# EAGLE design MEMS-preamp_v10 (EAGLE 8.6.0)
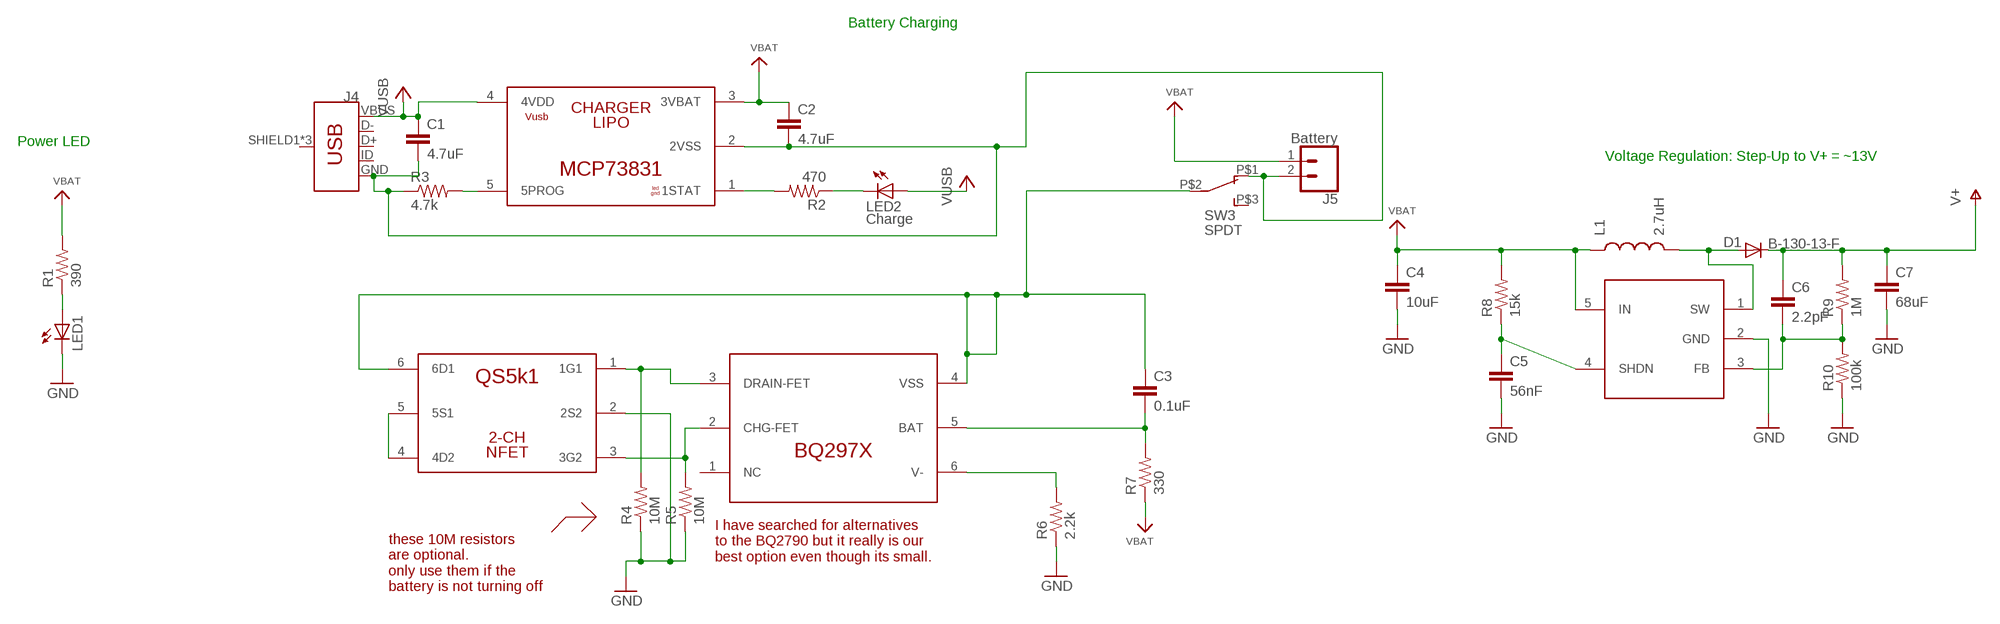
[diagram p0: schematic, sheet 1, part 1 of 2]
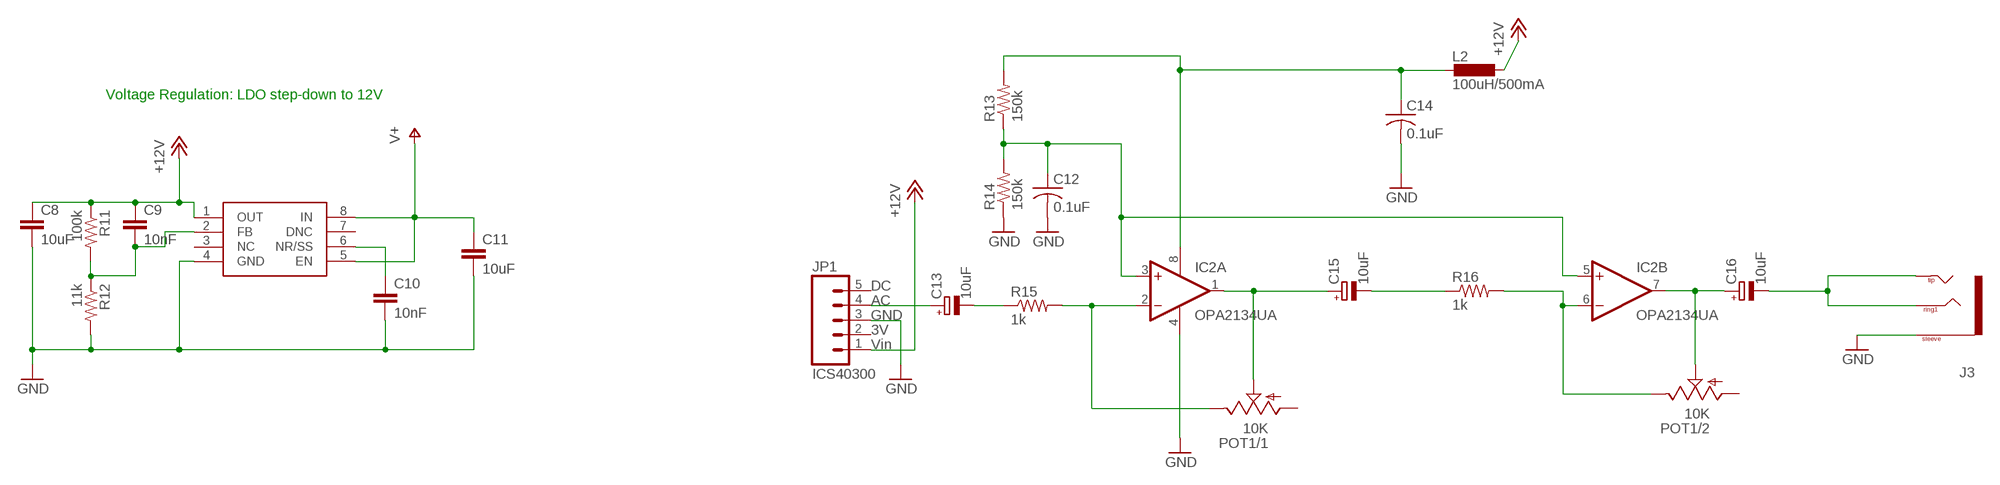
[diagram p1: schematic, sheet 1, part 2 of 2]

## Parts
C1  4.7uF  C-EUC0603  [C0603]
C2  4.7uF  C-EUC0603  [C0603]
C3  0.1uF  C-EUC0603  [C0603]
C4  10uF  C-EUC0603  [C0603]
C5  56nF  C-EUC0603  [C0603]
C6  2.2pF  C-EUC0603  [C0603]
C7  68uF  C-EUC1206  [C1206]
C8  10uF  C-EUC0603  [C0603]
C9  10nF  C-EUC0603  [C0603]
C10  10nF  C-EUC0603  [C0603]
C11  10uF  C-EUC0603  [C0603]
C12  0.1uF  C-USC0805  [C0805]
C13  10uF  CPOL-EUB  [PANASONIC_B]
C14  0.1uF  C-USC0805K  [C0805K]
C15  10uF  CPOL-EUB  [PANASONIC_B]
C16  10uF  CPOL-EUB  [PANASONIC_B]
D1  B-130-13-F  DIODESMA  [SMA-DIODE]
IC1  BQ297X  BQ297X-BATTERY-MANAGERLONG  [WSON-6-LONG]
IC2  OPA2134UA  [SO08]
IC3  MCP73831  [SOT-23-5]
IC4  SC4503  [SOT23-5]
IC5  TPS7A49  [MSOP-8]
IC6  QS6K1  [SOT457R_PHILIPS]
J3  TRS-1/8"-3.5MM  [TRS_SJ-3524-SMT]
J4  USB_MICRO-BREDUCED_PASTE  [USB-B-MICRO-SMD_RED_PASTE]
J5  Battery  CONN_02LOCK  [1X02_LOCK]
JP1  ICS40300  M05LOCK  [1X05_LOCK]
L1  2.7uH  INDUCTORCR54  [CR54]
L2  100uH/500mA  L-EUL3225M  [L3225M]
LED1  LED3MM  [LED3MM]
LED2  Charge  LED3MM  [LED3MM]
POT1  10K  POT-DUAL-PTV112-4420  [PTV112]
R1  390  R-US_R0603  [R0603]
R2  470  R-US_R0603  [R0603]
R3  4.7k  R-US_R0603  [R0603]
R4  10M  R-US_R0603  [R0603]
R5  10M  R-US_R0603  [R0603]
R6  2.2k  R-US_R0603  [R0603]
R7  330  R-US_R0603  [R0603]
R8  15k  R-US_R0603  [R0603]
R9  1M  R-US_R0603  [R0603]
R10  100k  R-US_R0603  [R0603]
R11  100k  R-US_R0603  [R0603]
R12  11k  R-US_R0603  [R0603]
R13  150k  R-US_R0603  [R0603]
R14  150k  R-US_R0603  [R0603]
R15  1k  R-US_R0603  [R0603]
R16  1k  R-US_R0603  [R0603]
SW3  SPDT  SWITCH_SPDTCL-SB-12B  [SWITCH_SPDT_CL-SB-12B]

## Nets
+5V: C1.1 IC3.4(4VDD) J4.VBUS LED2.A ; supply symbol labelled VUSB
+12V: C8.1 C9.1 IC5.1(OUT) JP1.1 L2.1 R11.1
BATGND: C3.1 IC1.4(VSS) IC6.6(6D1) SW3.P$2
GND: C4.2 C5.2 C7.2 C8.2 C10.2 C11.2 C12.2 C14.2 IC2.4(A:V-) IC4.2(GND) IC5.4(GND) IC6.2(2S2) J3.1(SLEEVE) JP1.3 LED1.K(C) R4.1 R5.1 R6.1 R10.1 R12.2 R14.1
N$2: LED1.A R1.1
N$3: C13.+ JP1.4
N$4: C15.- R16.1
N$5: IC2.2(A:-IN) POT1.1.3(/1:E) R15.2
N$6: IC3.5(5PROG) R3.2
N$7: C16.- J3.2(TIP) J3.3(RING1) J3.4(TIP)
N$8: C12.1 IC2.3(A:+IN) IC2.5(B:+IN) R13.1 R14.2
N$9: C15.+ IC2.1(A:OUT) POT1.1.2(/1:S)
N$10: C16.+ IC2.7(B:OUT) POT1.2.2(/2:S)
N$11: IC6.4(4D2) IC6.5(5S1)
N$12: D1.A IC4.1(SW) L1.P$2
N$13: C5.1 IC4.4(SHDN) R8.1
N$14: C6.2 IC4.3(FB) R9.1 R10.2
N$15: C14.1 IC2.8(A:V+) L2.2 R13.2
N$21: IC2.6(B:-IN) POT1.2.3(/2:E) R16.2
N$22: LED2.K(C) R2.1
N$23: C13.- R15.1
N$25: IC3.1(1STAT) R2.2
N$27: IC1.3(DRAIN-FET) IC6.1(1G1) R4.2
N$31: IC1.2(CHG-FET) IC6.3(3G2) R5.2
N$34: IC1.6(V-) R6.2
N$42: C3.2 IC1.5(BAT) R7.2
N$47: C9.2 IC5.2(FB) R11.2 R12.1
N$48: C10.1 IC5.6(NR/SS)
USBGND: C1.2 C2.2 IC3.2(2VSS) J4.GND J5.2 R3.1 SW3.P$1
V+: C6.1 C7.1 C11.1 D1.C IC5.5(EN) IC5.8(IN) R9.2
VBAT: C2.1 C4.1 IC3.3(3VBAT) IC4.5(IN) J5.1 L1.P$1 R1.2 R7.1 R8.2
Unconnected: IC1.1(NC) IC5.3(NC) IC5.7(DNC) J4.D+ J4.D- J4.ID J4.SHIELD1(SHIELD) J4.SHIELD2(SHIELD) J4.SHIELD3(SHIELD) JP1.2 JP1.5 POT1.1.1(/1:A) POT1.2.1(/2:A) SW3.P$3

## Notes on the sheet
- Battery Charging
- Power LED
- Voltage Regulation: Step-Up to V+ = ~13V | Voltage Regulation: LDO step-down to 12V
- I have searched for alternatives 
  to the BQ2790 but it really is our 
  best option even though its small.
- these 10M resistors
  are optional. 
  only use them if the 
  battery is not turning off

## Library data of the parts
C1-C11 = rcl:C-EU: CAPACITOR, European symbol; SPICEPREFIX: C
C12 C14 = adafruit:C-US: CAPACITOR, American symbol
C13 C15 C16 = CMU-ArtFab:CPOL-EU: POLARIZED CAPACITOR, European symbol
D1 = SparkFun:DIODE: Diode These are standard reverse protection diodes and small signal diodes. SMA package can handle up to about 1A. SOD-323 can handle about 200mA. What the SOD-323 package when ordering, there are some mfgs out there that are 5-pin packages.
IC1 = CMU-ArtFab:BQ297X-BATTERY-MANAGER
IC2 = linear:OPA2*: Dual Operational Amplifier Low Power, Single-Supply, Rail-To-Rail Operational Amplifier Source: http://focus.ti.com/lit/ds/symlink/opa2345.pdf http://focus.ti.com .. opa241.pdf http://focus.ti.com/lit/ds/symlink/opa2134.pdf
IC3 = CMU-ArtFab:MCP73831
IC4 = CMU-ArtFab:SC4503
IC5 = CMU-ArtFab:TPS7A49
IC6 = CMU-ArtFab:QS6K1
J3 = CMU-ArtFab:TRS-1/8"-3.5MM
J4 = CMU-ArtFab:USB_MICRO-B: USB Type Micro-B Connector Male/female and PTH/SMT variants SparkFun Products: SparkFun microB USB Breakout <https://www.sparkfun.com/products/12035> SparkFun USB microB Plug Breakout <https://www.sparkfun.com/products/10031> SparkFun ESP8266 Thing <https://www.sparkfun.com/products/13231>; PROD_ID: CONN-11752
J5 = SparkFun-Connectors:CONN_02: Multi connection point. Often used as Generic Header-pin footprint for 0.1 inch spaced/style header connections On any of the 0.1 inch spaced packages, you can populate with these: Break Away Headers - Straight <https://www.sparkfun.com/products/116> (PRT-00116) Break Away Male Headers - Right Angle <https://www.sparkfun.com/products/553> (PRT-00553) Female Headers <https://www.sparkfun.com/products/115> (PRT-00115) Break Away Headers - Machine Pin <https://www.sparkfun.com/products/117> (PRT-00117) Break Away Female Headers - Swiss Machine Pin <https://www.sparkfun.com/products/743> (PRT-00743) For SCREWTERMINALS and SPRING TERMINALS visit here: Screw Terimnals on SparkFun.com <https://www.sparkfun.com/search/results?term=Screw+Terminals> (5mm/3.5mm/2.54mm spacing) This device is also useful as a general connection point to wire up your design to another part of your project. Our various solder wires solder well into these plated through hole pads. Hook-Up Wire - Assortment (Stranded, 22 AWG) <https://www.sparkfun.com/products/11375> (PRT-11375) Hook-Up Wire - Assortment (Solid Core, 22 AWG) <https://www.sparkfun.com/products/11367> (PRT-11367) View the entire wire category on our website here <https://www.sparkfun.com/categories/141> Special notes: Molex polarized connector foot print use with: PRT-08233 with associated crimp pins and housings. 2.54_SCREWTERM for use with PRT-10571. 3.5mm Screw Terminal footprints for PRT-08084 5mm Screw Terminal footprints for use with PRT-08432
JP1 = SparkFun-Connectors:M05: Header 5 Standard 5-pin 0.1" header. Use with straight break away headers (SKU : PRT-00116), right angle break away headers (PRT-00553), swiss pins (PRT-00743), machine pins (PRT-00117), and female headers (PRT-00115). Molex polarized connector foot print use with SKU : PRT-08230 with associated crimp pins and housings.; CON1: Vin; CON2: 3V; CON3: GND; CON4: AC; CON5: DC
L1 = SparkFun-Passives:INDUCTOR: Inductors Basic Inductor/Choke - 0603 and 1206. Footprints are not proven and vary greatly between part numbers. SRN6045- 33uH, 20% 1.4A SDR0403-560KL - 56uH, 10%, 500mA RMS/740mA peak
L2 = rcl:L-EU: INDUCTOR, European symbol; SPICEPREFIX: L
LED1 LED2 = led:LED: LED OSRAM: - CHIPLED LG R971, LG N971, LY N971, LG Q971, LY Q971, LO R971, LY R971 LH N974, LH R974 LS Q976, LO Q976, LY Q976 LO Q996 - Hyper CHIPLED LW Q18S LB Q993, LB Q99A, LB R99A - SideLED LS A670, LO A670, LY A670, LG A670, LP A670 LB A673, LV A673, LT A673, LW A673 LH A674 LY A675 LS A676, LA A676, LO A676, LY A676, LW A676 LS A679, LY A679, LG A679 - Hyper Micro SIDELED® LS Y876, LA Y876, LO Y876, LY Y876 LT Y87S - SmartLED LW L88C, LW L88S LB L89C, LB L89S, LG L890 LS L89K, LO L89K, LY L89K LS L896, LA L896, LO L896, LY L896 - TOPLED LS T670, LO T670, LY T670, LG T670, LP T670 LSG T670, LSP T670, LSY T670, LOP T670, LYG T670 LG T671, LOG T671, LSG T671 LB T673, LV T673, LT T673, LW T673 LH T674 LS T676, LA T676, LO T676, LY T676, LB T676, LH T676, LSB T676, LW T676 LB T67C, LV T67C, LT T67C, LS T67K, LO T67K, LY T67K, LW E67C LS E67B, LA E67B, LO E67B, LY E67B, LB E67C, LV E67C, LT E67C LW T67C LS T679, LY T679, LG T679 LS T770, LO T770, LY T770, LG T770, LP T770 LB T773, LV T773, LT T773, LW T773 LH T774 LS E675, LA E675, LY E675, LS T675 LS T776, LA T776, LO T776, LY T776, LB T776 LHGB T686 LT T68C, LB T68C - Hyper Mini TOPLED® LB M676 - Mini TOPLED Santana® LG M470 LS M47K, LO M47K, LY M47K Source: http://www.osram.convergy.de LUXEON: - LUMILED® LXK2-PW12-R00, LXK2-PW12-S00, LXK2-PW14-U00, LXK2-PW14-V00 LXK2-PM12-R00, LXK2-PM12-S00, LXK2-PM14-U00 LXK2-PE12-Q00, LXK2-PE12-R00, LXK2-PE12-S00, LXK2-PE14-T00, LXK2-PE14-U00 LXK2-PB12-K00, LXK2-PB12-L00, LXK2-PB12-M00, LXK2-PB14-N00, LXK2-PB14-P00, LXK2-PB14-Q00 LXK2-PR12-L00, LXK2-PR12-M00, LXK2-PR14-Q00, LXK2-PR14-R00 LXK2-PD12-Q00, LXK2-PD12-R00, LXK2-PD12-S00 LXK2-PH12-R00, LXK2-PH12-S00 LXK2-PL12-P00, LXK2-PL12-Q00, LXK2-PL12-R00 Source: www.luxeon.com KINGBRIGHT: KA-3528ASYC Source: www.kingbright.com
POT1 = CMU-ArtFab:POT-DUAL-PTV112: Bourns 11mm dual potentiometer; AVAILABILITY: Unavailable; DESCRIPTION: Alt# Tce-10111410; MF: STMicroelectronics; MP: PTV112; PACKAGE: None; PRICE: None
R1-R16 = CMU-ArtFab:R-US_: RESISTOR, American symbol
SW3 = CMU-ArtFab:SWITCH_SPDT

## Board
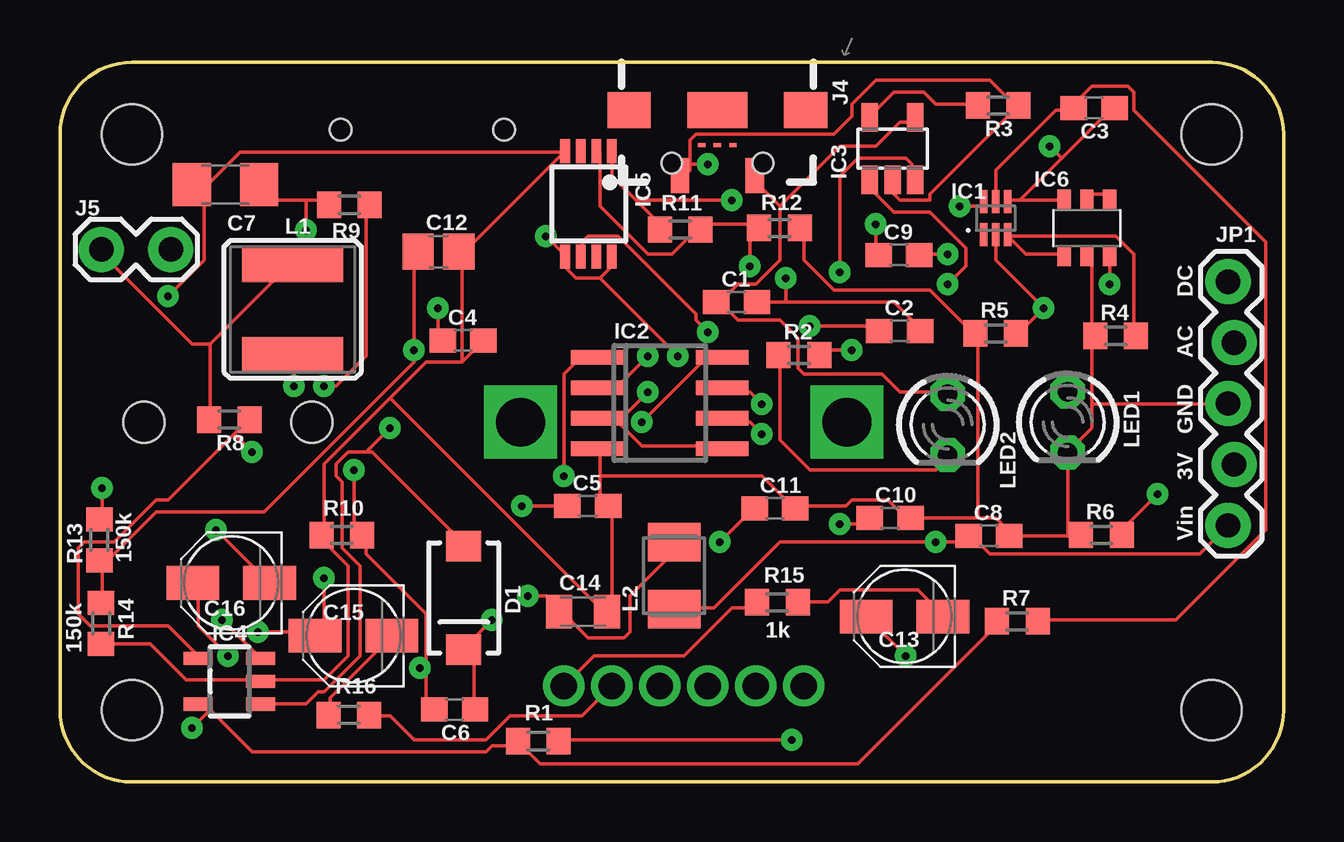
[diagram p2: board, top side]
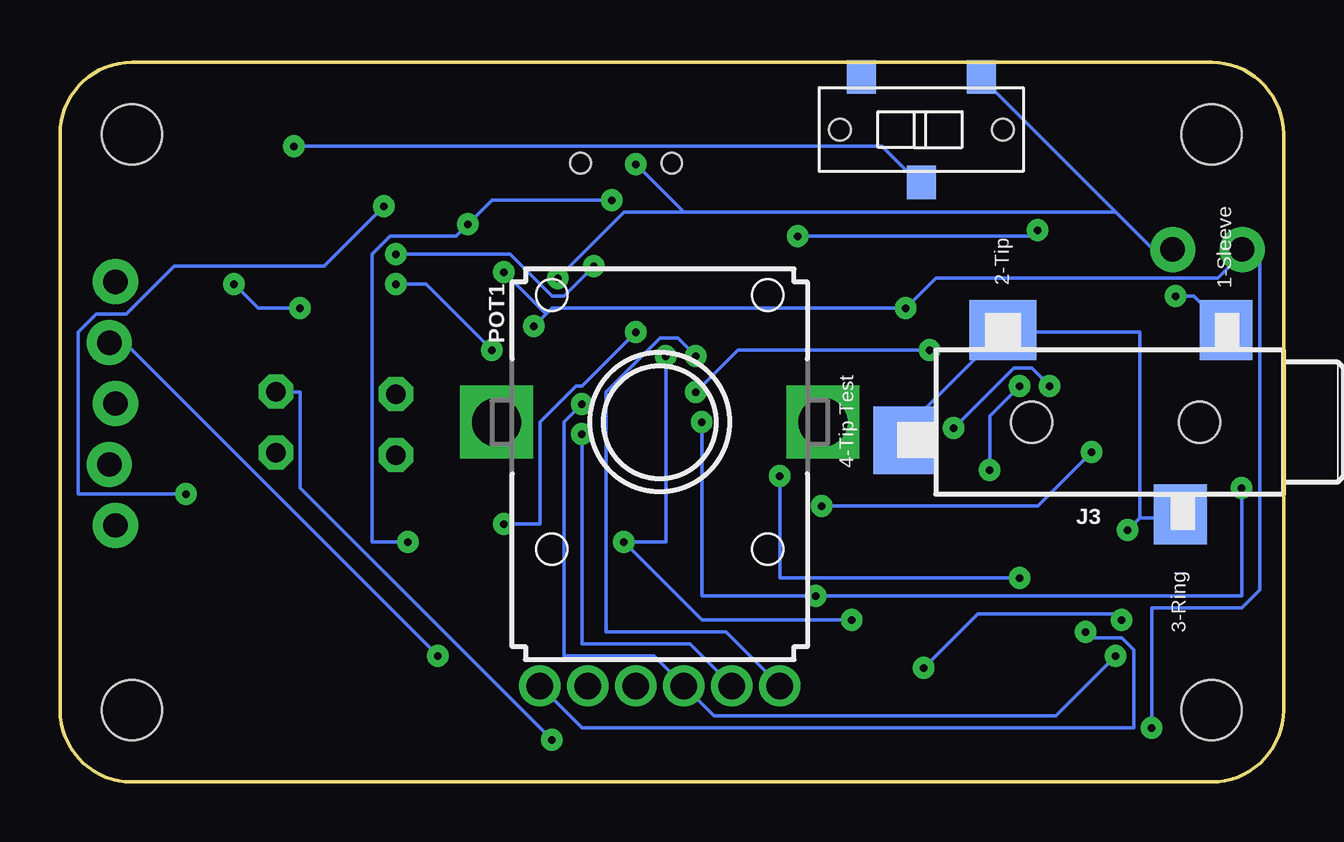
[diagram p3: board, bottom side, seen from below]

Size 51 x 30 mm. Coordinates in mm from the lower left corner, seen from the top.
Outline: 0,3 0,27 arc-90 3,30 48,30 arc-90 51,27 51,3 arc-90 48,0 3,0 arc-90 0,3
Copper layers (1*16): Top 0.035mm / dielectric 1.5mm / Bottom 0.035mm
Design rules "default *": minimum track width 6mil, minimum drill 12mil, track to track 6mil, track to pad 6mil, pad to pad 6mil, via to via 6mil, smd to smd 6mil, copper to edge 6mil, drill to drill 6mil, minimum pad ring 12mil, minimum via ring 12mil, stop-mask expansion 4mil, vias tented up to drill 0mil, thermal gap 10mil
Holes 2.5 mm at 48,27 48,3 3,27 3,3

### Footprints (pad centres in the part's own frame; a part is rotated, then mirrored left to right if it is on the bottom)
C0603 = smd 1.1 x 1: 1 -0.85,0; 2 0.85,0
C1206 = smd 1.6 x 1.8: 1 -1.4,0; 2 1.4,0
C0805 = smd 1.3 x 1.5: 1 -0.85,0; 2 0.85,0
PANASONIC_B = smd 2.2 x 1.4: + 1.6,0; - -1.6,0
C0805K = smd 1.1 x 1.4: 1 -1,0; 2 1,0
SMA-DIODE = smd 1.27 x 1.47: A -2.15,0; C 2.15,0
WSON-6-LONG = smd 0.3 x 0.954: 1 -0.5,-0.686; 2 0,-0.686; 3 0.5,-0.686; 4 0.5,0.686; 5 0,0.686; 6 -0.5,0.686
SO08 = smd 0.6 x 2.2: 1 -1.905,-2.6; 2 -0.635,-2.6; 3 0.635,-2.6; 4 1.905,-2.6; 5 1.905,2.6; 6 0.635,2.6; 7 -0.635,2.6; 8 -1.905,2.6
SOT-23-5 = smd 0.69 x 1.2: 1 -0.95,-1.3; 2 0,-1.3; 3 0.95,-1.3; 4 0.95,1.3; 5 -0.95,1.3
SOT23-5 = smd 0.55 x 1.2: 1 -0.95,-1.3; 2 0,-1.3; 3 0.95,-1.3; 4 0.95,1.3; 5 -0.95,1.3
MSOP-8 = smd 0.4 x 1: 1 -0.975,-2.2; 2 -0.325,-2.2; 3 0.325,-2.2; 4 0.975,-2.2; 5 0.975,2.2; 6 0.325,2.2; 7 -0.325,2.2; 8 -0.975,2.2
SOT457R_PHILIPS = smd 0.55 x 0.8: 1 -0.95,-1.2; 2 0,-1.2; 3 0.95,-1.2; 4 0.95,1.2; 5 0,1.2; 6 -0.95,1.2
TRS_SJ-3524-SMT = smd 2.5 x 2.2: 1 3.85,-4.6; 3 -3.85,-2.7 | smd 2.5 x 2.8: 2 3.85,4.7 | smd 2.8 x 2.5: 4 -0.75,8.85 | hole 1.7: 0,-3.5; 0,3.5
USB-B-MICRO-SMD_RED_PASTE = smd 0.152 x 0.305: D+ 1.455,0; D- 1.455,0.65; ID 1.455,-0.65 | smd 1.45 x 0.762: GND 2.725,-1.554 | smd 1.5 x 1.8: SHIELD1 0,3.685; SHIELD2 0,-3.685 | smd 1.5 x 2.5: SHIELD3 0,0 | smd 1.45 x 0.781: VBUS 2.725,1.554 | hole 0.85: 2.2,1.9; 2.2,-1.9
1X02_LOCK = drill 1.016 pad 1.88: 1 -0.178,0; 2 2.718,0
1X05_LOCK = drill 1.016 pad 1.88: 1 0,0.127; 2 2.54,-0.127; 3 5.08,0.127; 4 7.62,-0.127; 5 10.16,0.127
CR54 = smd 4.2 x 1.4: P$1 0,1.85; P$2 0,-1.85
L3225M = smd 1.6 x 2.2: 1 -1.4,0; 2 1.4,0
LED3MM = drill 0.813 octagon: A -1.27,0; K 1.27,0
PTV112 = drill 1.1 pad 1.676: 1.1 -3,-11; 1.2 -5,-11; 1.3 5,-11; 2.1 -1,-11; 2.2 1,-11; 2.3 3,-11 | drill 2.032 pad 2.8 square: M1 -6.8,0; M2 6.8,0
R0603 = smd 1 x 1.1: 1 -0.85,0; 2 0.85,0
SWITCH_SPDT_CL-SB-12B = smd 1.2 x 1.4: P$1 -2.5,-2.2; P$2 0,2.2; P$3 2.5,-2.2 | hole 0.9: -3.4,0; 3.4,0

### Placement (x,y rotation side)
C1  28.2,20 0 top
C2  35,18.8 0 top
C3  43.1,28.1 180 top
C4  16.8,18.4 0 top
C5  22,11.5 0 top
C6  16.45,3.02 180 top
C7  6.9,24.9 180 top
C8  38.72,10.26 0 top
C9  34.97,21.96 0 top
C10  34.6,11 0 top
C11  29.8,11.4 0 top
C12  15.77,22.1 0 top
C13  35.2,6.9 180 top
C14  21.8,7.1 0 top
C15  12.23,6.09 180 top
C16  7.14,8.3 180 top
D1  16.83,7.67 270 top
IC1  39,23.5 0 top
IC2  25,15.8 270 top
IC3  34.7,26.4 0 top
IC4  7.07,4.2 90 top
IC5  22.02,24.09 180 top
IC6  42.8,23.1 0 top
J3  7,15 90 bottom
J4  27.4,28 270 top
J5  1.9,22.2 0 top
JP1  48.81,10.7 90 top
L1  9.7,19.7 0 top
L2  25.6,8.6 90 top
LED1  42,15 270 top
LED2  37,14.9 270 top
POT1  26,15 0 bottom
R1  19.94,1.7 180 top
R2  30.8,17.8 0 top
R3  39.1,28.2 180 top
R4  44,18.6 0 top
R5  39,18.7 0 top
R6  43.4,10.3 0 top
R7  39.9,6.7 0 top
R8  7.06,15.1 180 top
R9  12.06,24.06 180 top
R10  11.75,10.29 0 top
R11  25.85,23.03 0 top
R12  29.99,23.09 0 top
R13  1.64,10.09 90 top
R14  1.72,6.61 90 top
R15  29.9,7.49 180 top
R16  12.04,2.79 0 top
SW3  15.1,27.2 180 bottom

### Tracks (layer width: path | path; a pad name or v marks a point on that pad's centre or on a via)
+5V
  Top 0.152: 27.5,20 28.25,20.75 29,20.75 30,21.75 30,24 | 30,24 28.75,25.25 J4.VBUS | 30,24 32.5,26.5 34,26.5 35,27.5 35.5,27.5 IC3.4 | 27.5,20 28.25,19.25 30,19.25 30.75,18.5 30.75,17.25 31,17 34.25,17 35,16.25 37,16.25 LED2.A | 27.5,20 C1.1
+12V  (via drill 0.3)
  Top 0.152: IC5.1 23,25.25 24,24.25 | 24,24.25 25,23.25 R11.1 | v34,23.25 34,22 C9.1 | 24,24.25 v28,24.25 | 38.25,10 38.75,9.5 47.5,9.5 48.5,10.5 JP1.1 | 38.25,10 38,10.25 C8.1 38.25,10 | 38.25,10 v36.5,10 30,10 27.25,7.25 25.75,7.25 L2.1
  Bottom 0.152: v28,24.25 33,24.25 v34,23.25 34.5,22.75 37.25,22.75 38,22 38,10 v36.5,10
BATGND  (via drill 0.3)
  Top 0.152: 40,24.25 39.5,24.25 IC1.4 | 40,24.25 41.75,24.25 IC6.6 | 40,24.25 41.75,26 | 41.75,26 43.75,28 C3.1 | 41.75,26 v41.25,26.5
  Bottom 0.152: v41.25,26.5 16.75,26.5 15.25,25 SW3.P$2
GND  (via drill 0.3)
  Top 0.152: 16.75,22 21,26.25 | 6,25 6.25,25 7.5,26.25 21,26.25 | 6,25 5.5,25 C7.2 6,25 | 21,26.25 IC5.4 | v4.5,20.25 6,21.75 6,25 | R14.1 1.75,5.75 3.75,5.75 5.25,4.25 8.25,4.25 IC4.2 8.5,4.25 11,4.25 12,5.25 12,9 10.75,10.25 R10.1 11,10.5 11,13.25 13.75,16 | 13.75,16 15.25,17.5 16.75,17.5 | C4.2 16.75,17.5 | 16.75,17.5 16.75,22 | 16.75,22 C12.2 | IC6.2 43,21.75 43,18.75 R4.1 43,18.5 43,15.75 | 43,15.75 43,14.75 42,13.75 LED1.K 42,10.25 | 43,15.75 48.5,15.75 JP1.3 | 22.5,12.75 22.5,11.75 22.75,11.5 C5.2 23,11.5 23,7.25 C14.2 22.75,7 13.75,16 | 22.5,12.75 22.5,13.75 IC2.4 | 42,10.25 42.5,10.25 R6.1 | 42,10.25 39.75,10.25 C8.2 39.5,10.5 39,11 38.25,11 | 38.25,11 C10.2 35.25,11 34.5,11.75 33,11.75 32.75,11.5 30.75,11.5 C11.2 30.5,11.5 29.25,12.75 22.5,12.75 | 38.25,11 38.25,18.5 R5.1 38,18.75 36.25,20.5 32.25,20.5 31,21.75 31,23 R12.2
  Bottom 0.152: v4.5,20.25 3.75,20.25 2.5,19 J3.1
N$2  (via drill 0.3)
  Top 0.152: v30.5,1.75 21,1.75 R1.1
  Bottom 0.152: v30.5,1.75 41,12.25 41,16.25 42,16.25 LED1.A
N$3  (via drill 0.3)
  Top 0.152: v35.25,5.25 C13.+
  Bottom 0.152: v35.25,5.25 48.25,18.25 48.75,18.25 JP1.4
N$4
  Top 0.152: R16.1 11.25,3 11.25,3.5 13.75,6 C15.-
N$5  (via drill 0.3)
  Top 0.152: POT1.1.3 22.25,5.25 26,5.25 28,7.25 29,7.25 R15.2 | v24.5,17.75 23.25,16.5 22.5,16.5 IC2.2
  Bottom 0.152: v24.5,17.75 25.25,18.5 26,18.5 28.25,16.25 28.25,6.25 23.25,6.25 POT1.1.3
N$6
  Top 0.152: R3.2 38.25,28.25 36.5,28.25 36,28.75 34.75,28.75 33.75,27.75 IC3.5
N$7  (via drill 0.3)
  Top 0.152: v6.5,10.5 8.5,8.5 C16.-
  Bottom 0.152: 6,11 v6.5,10.5 | 6,11 4.5,11 J3.3 | J3.4 15.75,14.25 15.75,14.75 11.75,18.75 J3.2 11.5,18.75 6,18.75 6,11
N$8  (via drill 0.3)
  Top 0.152: 23.25,15 22.5,15 IC2.3 23.25,15 | 23.25,15 24.25,14 27.5,14 IC2.5 | 1.75,9 1.75,7.5 R14.2 | 1.75,9 4,11.25 8.5,11.25 14.75,17.5 v14.75,18 14.75,22 C12.1 | 1.75,9 R13.1 | v24.5,16.25 23.25,15
  Bottom 0.152: v24.5,16.25 22.75,18 v14.75,18
N$9  (via drill 0.3)
  Top 0.152: v8.25,6.25 10.5,6.25 C15.+ 10.75,6.25 11,6.5 v11,8.5 | v21,12.75 21,17 21.5,17.5 22.25,17.5 IC2.1
  Bottom 0.152: v8.25,6.25 8,6 6.75,6 6.25,5.5 6.25,2.25 29.25,2.25 POT1.1.2 | v21,12.75 21,8.5 v11,8.5
N$10  (via drill 0.3)
  Top 0.152: v7,5.25 5.75,6.5 5.75,8.25 C16.+ | v29.25,15.75 28.75,16.25 27.75,16.25 IC2.7
  Bottom 0.152: v7,5.25 9.5,2.75 23.75,2.75 POT1.2.2 26.25,5.25 30,5.25 30,15 v29.25,15.75
N$11
  Top 0.152: IC6.5 43,24.5 43.75,24.5 IC6.4
N$12  (via drill 0.3)
  Top 0.152: IC4.1 10.25,3.25 10.75,3.75 11,3.75 12.5,5.25 12.5,9 11.75,9.75 11.75,12.5 11.5,12.75 11.5,13.25 12,13.75 12.75,13.75 | 12.75,13.75 13,13.75 16.75,10 D1.A | v9.75,16.5 9.75,17.75 L1.P$2 | 12.75,13.75 v13.75,14.75
  Bottom 0.152: v9.75,16.5 10.5,17.25 11.25,17.25 v13.75,14.75
N$13  (via drill 0.3)
  Top 0.152: 7.25,14.5 4.5,11.75 4,11.75 2.25,10 1,10 0.75,9.75 0.75,7 1.25,6.5 4.5,6.5 5.75,5.25 IC4.4 | 7.25,14.5 7.75,15 R8.1 | v19.25,11.5 C5.1 | 7.25,14.5 v8,13.75
  Bottom 0.152: v19.25,11.5 10.25,11.5 v8,13.75
N$14  (via drill 0.3)
  Top 0.152: 15.25,4.75 15.25,3.5 15.5,3.25 C6.2 | 15.25,4.75 15.25,7 12.75,9.5 12.75,10.25 R10.2 12.5,10.5 12.25,10.75 v12.25,13 | v11,16.5 11.5,16.5 12.75,17.75 12.75,24 R9.1 | v6.75,6.75 8.25,5.25 IC4.3 | 15.25,4.75 v15,4.75
  Bottom 0.152: v11,16.5 12.25,15.25 v12.25,13 | v6.75,6.75 7,7 12.75,7 v15,4.75
N$15  (via drill 0.3)
  Top 0.152: v1.75,12.25 1.75,11 R13.2 | v19.5,7.75 20.25,7.75 20.75,7.25 C14.1 21,7 22,6 23.5,6 23.75,6.25 23.75,7.75 25.5,9.5 25.5,10 L2.2 | v24.25,15 26.75,17.5 27.5,17.5 IC2.8
  Bottom 0.152: v1.75,12.25 1.75,7.75 v19.5,7.75 24.25,7.75 v24.25,15
N$21  (via drill 0.3)
  Top 0.152: POT1.2.3 21.75,2.75 18.75,2.75 17.75,1.75 14.75,1.75 13.75,2.75 13,2.75 R16.2 | v29.25,14.5 28.75,15 27.75,15 IC2.6
  Bottom 0.152: v29.25,14.5 29.25,5.75 24.75,5.75 POT1.2.3
N$22
  Top 0.152: R2.1 30,17.75 30,14.25 31.25,13 36.5,13 37,13.5 LED2.K
N$23
  Top 0.152: R15.1 32,7.5 32.5,8 35.75,8 36.75,7 C13.-
N$25  (via drill 0.3)
  Top 0.152: v33,18 31.75,18 R2.2 | v37,20.75 37.75,21.5 37.75,22.25 36.25,23.75 34.75,23.75 33.75,24.75 IC3.1
  Bottom 0.152: v33,18 35.75,20.75 v37,20.75
N$27
  Top 0.152: 39.5,22.75 40.25,22 41.75,22 IC6.1 | 39.5,22.75 44,22.75 44.75,22 44.75,18.75 R4.2 | 39.5,22.75 IC1.3
N$31  (via drill 0.3)
  Top 0.152: v43.75,20.75 IC6.3 | R5.2 40,18.75 v41,19.75 39,21.75 IC1.2
  Bottom 0.152: v43.75,20.75 42.75,19.75 v41,19.75
N$34  (via drill 0.3)
  Top 0.152: v37.5,24 38.5,24 IC1.6 | v45.75,12 44.25,10.5 R6.2
  Bottom 0.152: v37.5,24 40,21.5 46.25,21.5 48.25,19.5 49.5,19.5 50.25,18.75 50.25,12 v45.75,12
N$42
  Top 0.152: IC1.5 39,25.5 41.5,28 42.25,28 C3.2 42.25,28.25 43,29 44.5,29 44.75,28.75 44.75,28 50.25,22.5 50.25,10.5 46.5,6.75 40.75,6.75 R7.2
N$47  (via drill 0.3)
  Top 0.152: IC5.2 22.5,26.25 22.5,24 24.5,22 25.5,22 26.5,23 R11.2 26.75,23.25 28.75,23.25 | 28.75,23.25 29,23.25 R12.1 28.75,23.25 | v37,22 36,22 C9.2 | 28.75,23.25 v28.75,21.5
  Bottom 0.152: v37,22 32.25,22 30.5,20.25 30,20.25 v28.75,21.5
N$48  (via drill 0.3)
  Top 0.152: v27,18.75 26.5,19.25 26.5,19.5 23.25,22.75 22,22.75 21.75,22.5 21.75,22 IC5.6 | v32.5,10.75 33.5,10.75 C10.1
  Bottom 0.152: v27,18.75 29.25,16.5 29.5,16.5 31,15 31,10.75 v32.5,10.75
USBGND  (via drill 0.3)
  Top 0.152: IC3.2 34.75,25 34.75,24.5 35,24.25 36.25,24.25 36.25,24.5 R3.1 39.75,28.25 38.75,29.25 34,29.25 33,28.25 33,27.75 32.25,27 26.5,27 26.25,26.75 26.25,25.75 | 26.25,25.75 26.25,25.5 26,25.25 J4.GND | C1.2 30.25,20 | 30.25,20 34.75,20 35.75,19 C2.2 | v30.25,21 30.25,20 | v27,25.75 26.25,25.75
  Bottom 0.152: 7,23.75 5.5,22.25 4.75,22.25 J5.2 | 7,23.75 12.5,29.25 SW3.P$1 | v30.25,21 27.5,23.75 25,23.75 | 7,23.75 25,23.75 | 25,23.75 v27,25.75
V+  (via drill 0.3)
  Top 0.152: 10.25,24.25 9,24.25 8.5,24.75 C7.1 | 10.25,24.25 11,24.25 R9.2 | 22.5,21 21.5,21 21,21.5 21,21.75 IC5.5 21,22 v20.25,22.75 | 22.5,21 23,21.5 IC5.8 | C6.1 17.25,3.25 17.25,5.25 17,5.5 D1.C 17,5.75 v18,6.75 | v27.5,10 28.75,11.25 C11.1 | v25.75,17.75 22.5,21 | v10.25,23 10.25,24.25
  Bottom 0.152: v18,6.75 24.25,6.75 v27.5,10 25.75,10 v25.75,17.75 | v10.25,23 10.5,22.75 v20.25,22.75
VBAT  (via drill 0.3)
  Top 0.152: 6.25,3 6,3.25 IC4.5 6.25,3 | 6.25,3 8,1.25 17.75,1.25 18,1.5 19,1.5 R1.2 19.25,1.5 20,0.75 33.25,0.75 39,6.5 R7.1 | 6.25,18.25 6.25,15.25 R8.2 | 6.25,18.25 9.5,21.5 L1.P$1 | v15.75,19.75 15.75,18.5 C4.1 | v31.25,19 34,19 C2.1 | v32.5,21.25 32.5,25.25 33.25,26 35.25,26 35.5,25.75 35.5,25.25 IC3.3 | 6.25,18.25 5.5,18.25 1.75,22 J5.1 | v5.5,2.25 6.25,3
  Bottom 0.152: 30.75,19.5 30.5,19.75 v15.75,19.75 14.5,21 2.75,21 1.75,22 J5.1 1.5,22 1,22 1,8 1.75,7.25 5.5,7.25 v5.5,2.25 | 30.75,19.5 v31.25,19 | 30.75,19.5 v32.5,21.25

### Text on the board
bValues: ON | OFF